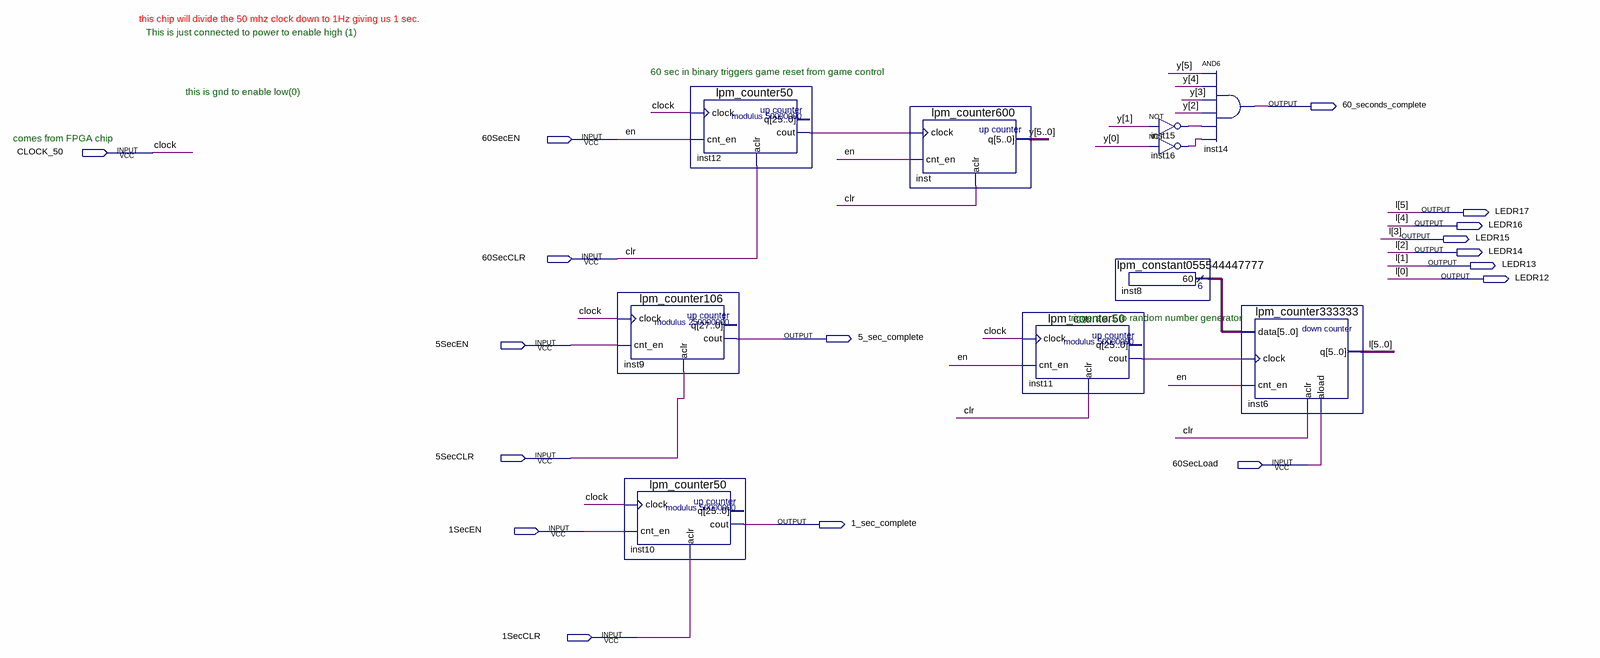
[diagram p0: schematic sheet]
// Quartus schematic ClockCounter3.bdf as structural Verilog: 10 symbols, 17 pins
module ClockCounter3 (
  input  \60SecEN ,
  input  CLOCK_50,
  input  \60SecCLR ,
  input  \5SecEN ,
  input  \5SecCLR ,
  input  \60SecLoad ,
  input  \1SecEN ,
  input  \1SecCLR ,
  output \60_seconds_complete ,
  output LEDR17,
  output LEDR16,
  output LEDR15,
  output LEDR14,
  output LEDR13,
  output LEDR12,
  output \5_sec_complete ,
  output \1_sec_complete 
);

  wire inst11_cout, inst12_cout, inst15_out, inst16_out;
  wire [5:0] inst8_result, y;

  lpm_counter106 inst9 (.clock(CLOCK_50), .cnt_en(\5SecEN ), .aclr(\5SecCLR ), .cout(\5_sec_complete ));  // open: q
  lpm_counter50 inst10 (.clock(CLOCK_50), .cnt_en(\1SecEN ), .aclr(\1SecCLR ), .cout(\1_sec_complete ));  // open: q
  lpm_counter50 inst12 (.clock(CLOCK_50), .cnt_en(\60SecEN ), .aclr(\60SecCLR ), .cout(inst12_cout));  // open: q
  lpm_counter600 inst (.clock(inst12_cout), .cnt_en(\60SecEN ), .aclr(\60SecCLR ), .q(y));
  lpm_counter50 inst11 (.clock(CLOCK_50), .cnt_en(\60SecEN ), .aclr(\60SecCLR ), .cout(inst11_cout));  // open: q
  lpm_constant055544447777 inst8 (.result(inst8_result));
  not inst15 (inst15_out, y[1]);
  not inst16 (inst16_out, y[0]);
  and inst14 (\60_seconds_complete , y[5], y[4], y[3], y[2], inst15_out, inst16_out);
  lpm_counter333333 inst6 (
    .data(inst8_result), .clock(inst11_cout), .cnt_en(\60SecEN ), .aclr(\60SecCLR ), .aload(\60SecLoad ),
    .q({LEDR17, LEDR16, LEDR15, LEDR14, LEDR13, LEDR12}));

  // Other names for the same wires on the sheet: clock = CLOCK_50; clr = \60SecCLR ; en = \60SecEN ;
  //   l[5:0] = {LEDR17, LEDR16, LEDR15, LEDR14, LEDR13, LEDR12}

  // Notes on the sheet:
  //   this chip will divide the 50 mhz clock down to 1Hz giving us 1 sec.
  //   This is just connected to power to enable high (1)
  //   60 sec in binary triggers game reset from game control
  //   this is gnd to enable low(0)
  //   comes from FPGA chip
  //   triggers a 1 to random number generator
endmodule
